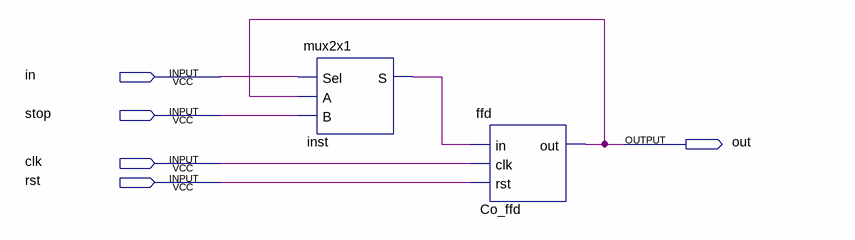
[diagram p0: schematic sheet]
// Quartus schematic synccounter_base.bdf as structural Verilog: 2 symbols, 5 pins
module synccounter_base (
  input  in,
  input  stop,
  input  clk,
  input  rst,
  output out
);

  wire inst_s;

  mux2x1 inst (.Sel(in), .A(out), .B(stop), .S(inst_s));
  ffd Co_ffd (.in(inst_s), .clk(clk), .rst(rst), .out(out));
endmodule
